# EAGLE design sensors (EAGLE 7.4.0)
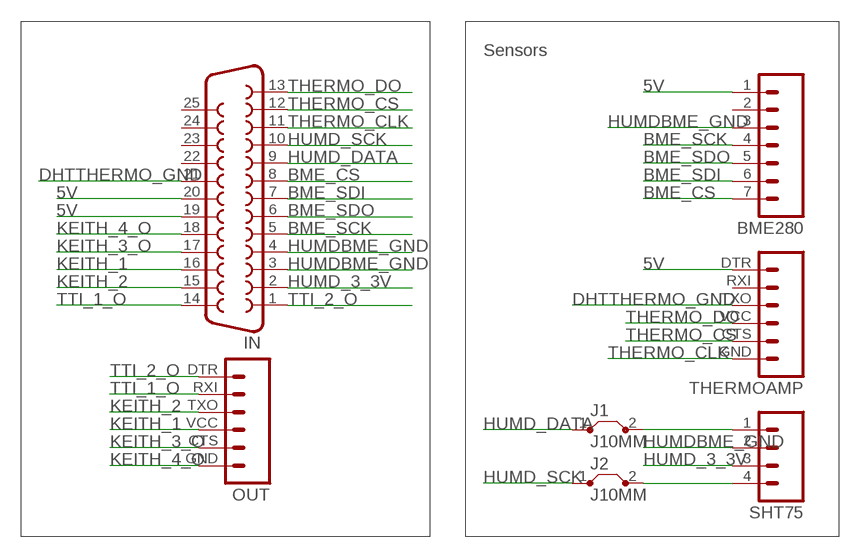
[diagram p0: schematic, sheet 1]

## Parts
BME280  M07  [1X07]
IN  F25HP  [F25HP]
J1  J10MM  [10]
J2  J10MM  [10]
OUT  M06SIP  [1X06]
SHT75  M04SMD_LONG  [1X04-SMD_LONG]
THERMOAMP  M06SIP  [1X06]

## Nets
5V: BME280.1 IN.19 IN.20 THERMOAMP.DTR
BME_CS: BME280.7 IN.8
BME_SCK: BME280.4 IN.5
BME_SDI: BME280.6 IN.7
BME_SDO: BME280.5 IN.6
DHTTHERMO_GND: IN.21 THERMOAMP.TXO
HUMD_3_3V: IN.2 SHT75.3
HUMD_DATA: IN.9 J1.1
HUMD_SCK: IN.10 J2.1
HUMDBME_GND: BME280.3 IN.3 IN.4 SHT75.2
KEITH_1: IN.16 OUT.VCC
KEITH_2: IN.15 OUT.TXO
KEITH_3_O: IN.17 OUT.CTS
KEITH_4_O: IN.18 OUT.GND
N$1: J1.2 SHT75.1
N$2: J2.2 SHT75.4
THERMO_CLK: IN.11 THERMOAMP.GND
THERMO_CS: IN.12 THERMOAMP.CTS
THERMO_DO: IN.13 THERMOAMP.VCC
TTI_1_O: IN.14 OUT.RXI
TTI_2_O: IN.1 OUT.DTR
Unconnected: BME280.2 IN.22 IN.23 IN.24 IN.25 THERMOAMP.RXI

## Notes on the sheet
- Sensors

## Library data of the parts
BME280 = SparkFun-Connectors:M07: Header 7 Standard 7-pin 0.1" header. Use with straight break away headers (SKU : PRT-00116), right angle break away headers (PRT-00553), swiss pins (PRT-00743), machine pins (PRT-00117), and female headers (PRT-00115). NOTES ON THE VARIANTS LOCK and LOCK_LONGPADS... This footprint was designed to help hold the alignment of a through-hole component (i.e. 7-pin header) while soldering it into place. You may notice that each hole has been shifted either up or down by 0.005 of an inch from it's more standard position (which is usually a perfectly straight line). This slight alteration caused the pins (the squares in the middle) to touch the edges of the holes. Because they are alternating, it causes a "brace" to hold the header in place. 0.005 has proven to be the perfect amount of "off-center" position when using our standard breakaway headers. Although looks a little odd when you look at the bare footprint, once you have a header in there, the alteration is very hard to notice. Also, if you push a header all the way into place, it is covered up entirely on the bottom side. This idea of altering the position of holes to aid alignment will be further integrated into the Sparkfun Library for other footprints. It can help hold any component with 3 or more connection pins.
IN = SparkFun-Connectors:F25: 25 Pin male connector. PCB edge mount for regular PCB thicknesses. This connector will connect directly to the back of a PC parallel port or through a normal DB25 extension cable (M/F). SKU: PRT-08287
J1 J2 = jumper:J: Bridge
OUT THERMOAMP = SparkFun-Connectors:M06: Header 6 Standard 6-pin 0.1" header. Use with straight break away headers (SKU : PRT-00116), right angle break away headers (PRT-00553), swiss pins (PRT-00743), machine pins (PRT-00117), and female headers (PRT-00115). Molex polarized connector foot print use with SKU : PRT-08094 with associated crimp pins and housings. NOTES ON THE VARIANTS LOCK and LOCK_LONGPADS... This footprint was designed to help hold the alignment of a through-hole component (i.e. 6-pin header) while soldering it into place. You may notice that each hole has been shifted either up or down by 0.005 of an inch from it's more standard position (which is a perfectly straight line). This slight alteration caused the pins (the squares in the middle) to touch the edges of the holes. Because they are alternating, it causes a "brace" to hold the component in place. 0.005 has proven to be the perfect amount of "off-center" position when using our standard breakaway headers. Although looks a little odd when you look at the bare footprint, once you have a header in there, the alteration is very hard to notice. Also,if you push a header all the way into place, it is covered up entirely on the bottom side. This idea of altering the position of holes to aid alignment will be further integrated into the Sparkfun Library for other footprints. It can help hold any component with 3 or more connection pins.
SHT75 = SparkFun-Connectors:M04: Header 4 Standard 4-pin 0.1" header. Use with straight break away headers (SKU : PRT-00116), right angle break away headers (PRT-00553), swiss pins (PRT-00743), machine pins (PRT-00117), and female headers (PRT-00115). Molex polarized connector foot print use with SKU : PRT-08231 with associated crimp pins and housings. 1MM SMD Version SKU: PRT-10208

## Net classes
0 default: width 0.254 mm, clearance 0.254 mm

## Board
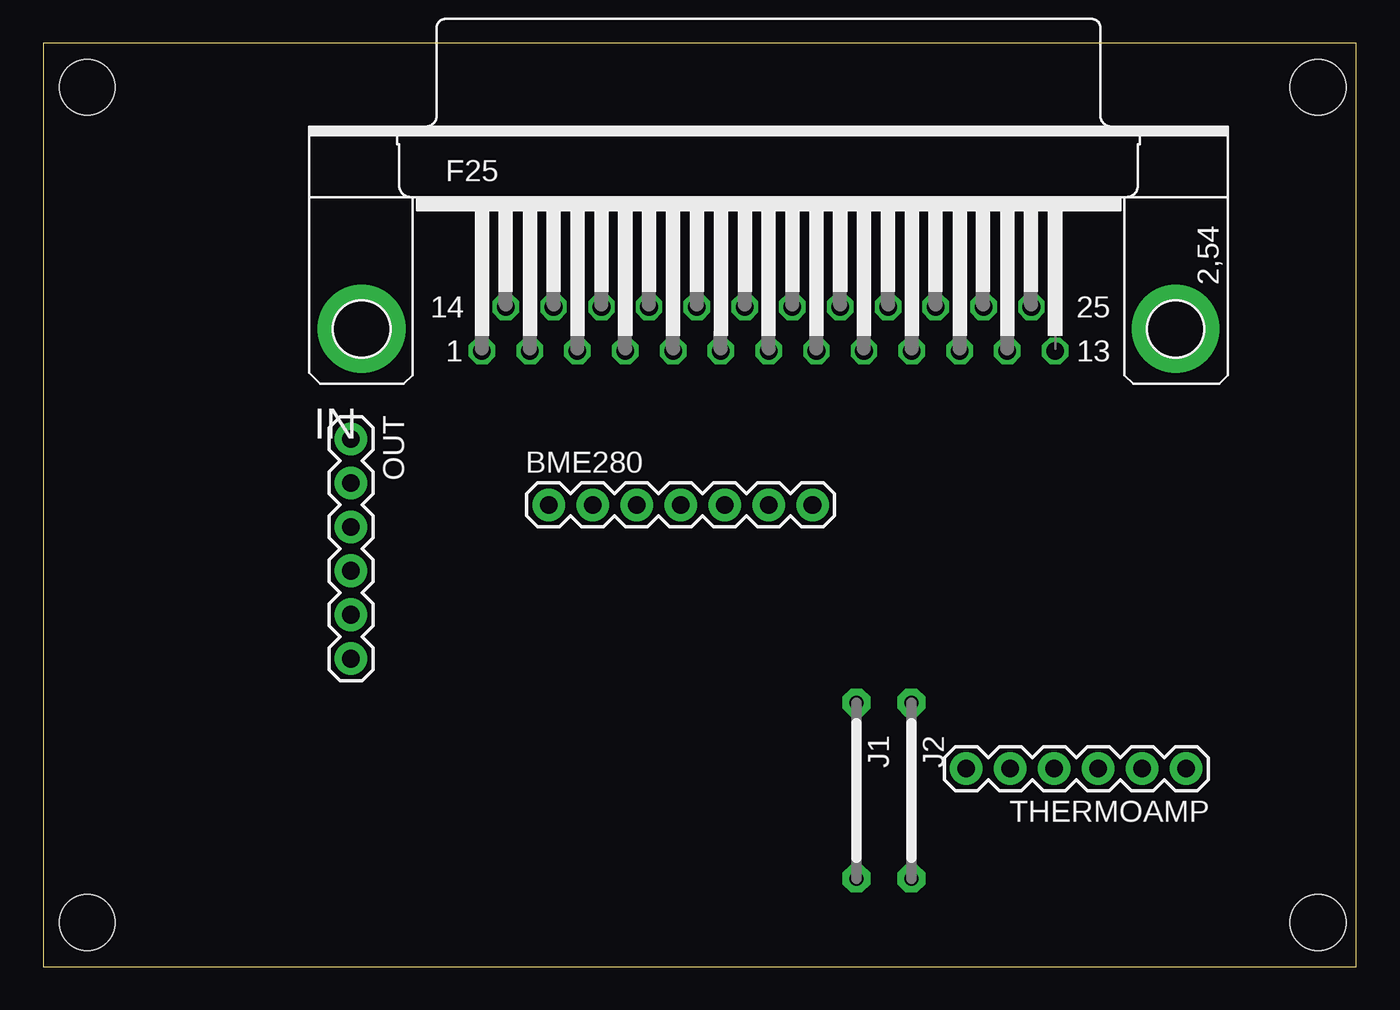
[diagram p1: board, top side]
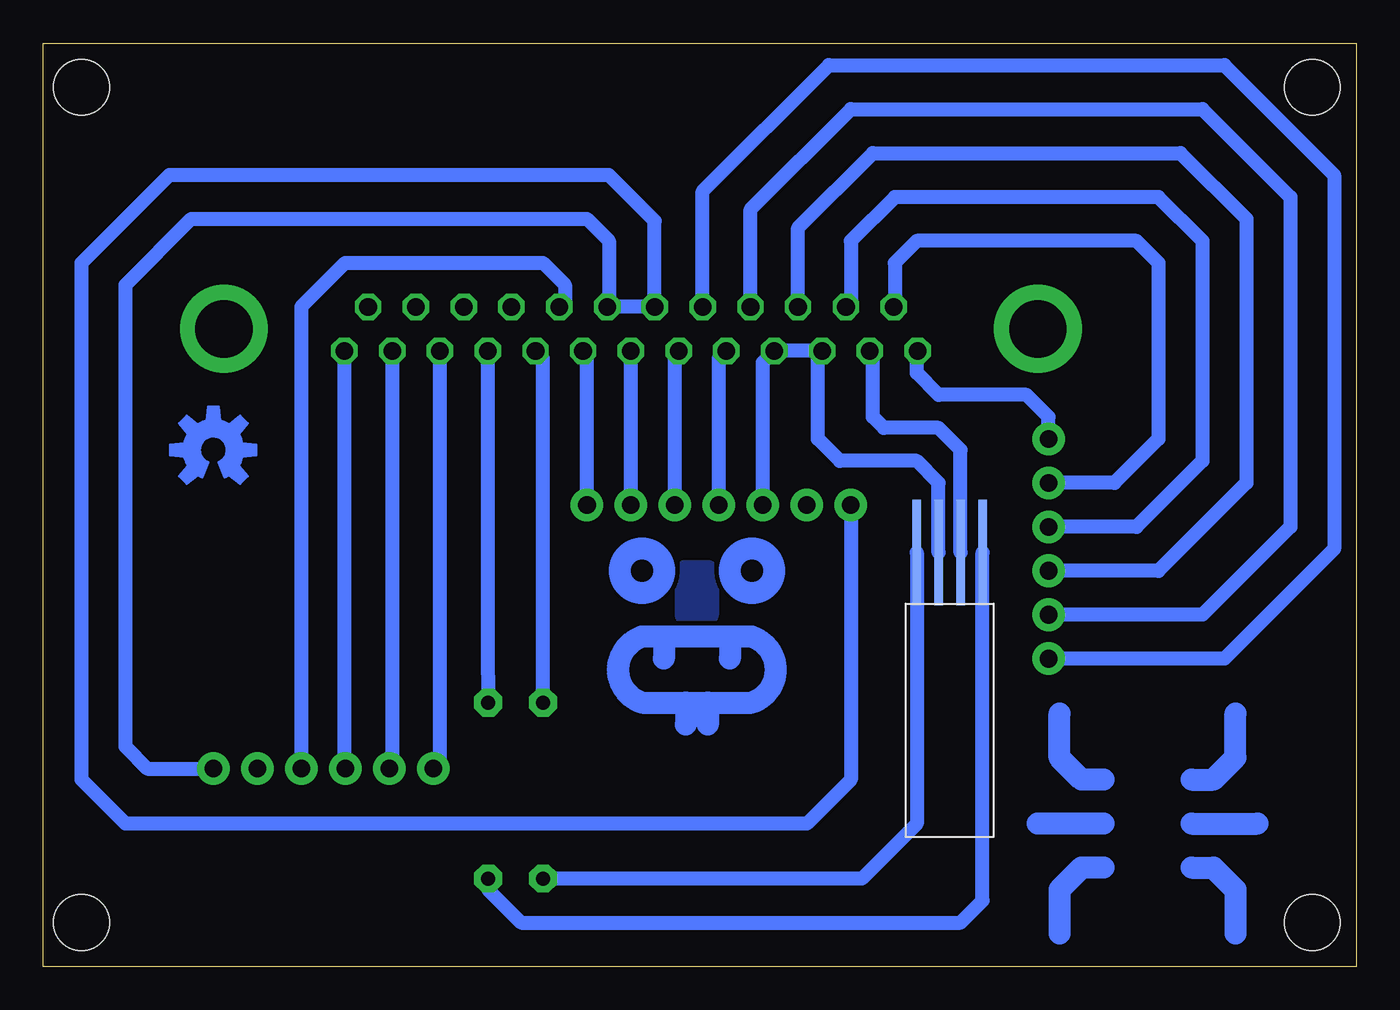
[diagram p2: board, bottom side, seen from below]

Size 75.87 x 53.33 mm. Coordinates in mm from the lower left corner, seen from the top.
Outline: 0,0 75.87,0 75.87,53.33 0,53.33 0,0
Copper layers (1*16): Top 0.035mm / dielectric 1.5mm / Bottom 0.035mm
Design rules "default": minimum track width 10mil, minimum drill 24mil, track to track 8mil, track to pad 8mil, pad to pad 8mil, via to via 8mil, smd to smd 8mil, copper to edge 40mil, drill to drill 8mil, minimum pad ring 10mil, minimum via ring 8mil, stop-mask expansion 4mil, vias tented up to drill 0mil, thermal gap 10mil
Holes 3.2 mm at 2.54,50.8 73.66,50.8 2.54,2.54 73.66,2.54

### Footprints (pad centres in the part's own frame; a part is rotated, then mirrored left to right if it is on the bottom)
1X07 = drill 1.016 pad 1.88: 1 0,0; 2 2.54,0; 3 5.08,0; 4 7.62,0; 5 10.16,0; 6 12.7,0; 7 15.24,0
F25HP = drill 1.016 octagon: 1 -16.561,-1.27; 2 -13.792,-1.27; 3 -11.049,-1.27; 4 -8.28,-1.27; 5 -5.512,-1.27; 6 -2.769,-1.27; 7 0,-1.27; 8 2.769,-1.27; 9 5.512,-1.27; 10 8.28,-1.27; 11 11.049,-1.27; 12 13.792,-1.27; 13 16.561,-1.27; 14 -15.189,1.27; 15 -12.421,1.27; 16 -9.652,1.27; 17 -6.909,1.27; 18 -4.14,1.27; 19 -1.372,1.27; 20 1.372,1.27; 21 4.14,1.27; 22 6.909,1.27; 23 9.652,1.27; 24 12.421,1.27; 25 15.189,1.27 | drill 3.302 pad 5.08: G1 -23.52,0; G2 23.52,0
10 = drill 0.813 pad 1.6 octagon: 1 -5.08,0; 2 5.08,0
1X06 = drill 1.016 pad 1.88: CTS 10.16,0; DTR 0,0; GND 12.7,0; RXI 2.54,0; TXO 5.08,0; VCC 7.62,0
1X04-SMD_LONG = smd 0.508 x 6.096: 1 -1.905,5.5; 2 -0.635,5.5; 3 0.635,5.5; 4 1.905,5.5

### Placement (x,y rotation side)
BME280  29.21,26.67 0 top
IN  41.91,36.83 0 top
J1  46.99,10.16 270 top
J2  50.16,10.16 270 top
OUT  17.78,30.48 270 top
SHT75  23.5,18.41 0 bottom
THERMOAMP  66.04,11.43 180 top
U$1  [OSHW-LOGO-M]  66.04,29.84 0 top

### Tracks (layer width: path | path; a pad name or v marks a point on that pad's centre or on a via)
5V
  Bottom 0.813: THERMOAMP.DTR 69.85,11.43 71.12,12.7 71.12,39.37 67.31,43.18 44.45,43.18 43.18,41.91 43.18,38.2 IN.20 IN.19 40.54,43.08 43.18,45.72 68.58,45.72 73.66,40.64 73.66,13.34 73.66,12.7 73.66,10.79 71.12,8.26 31.75,8.26 29.21,10.79 BME280.1
BME_CS
  Bottom 0.813: BME280.7 44.45,35.33 IN.8
BME_SCK
  Bottom 0.813: BME280.4 36.83,35.13 IN.5
BME_SDI
  Bottom 0.813: BME280.6 IN.7
BME_SDO
  Bottom 0.813: BME280.5 39.37,35.33 IN.6
DHTTHERMO_GND
  Bottom 0.813: IN.21 45.72,38.43 45.72,39.37 46.99,40.64 58.42,40.64 60.96,38.1 THERMOAMP.TXO
HUMD_3_3V
  Bottom 0.813: IN.2 27.94,35.38 27.94,31.75 27.3,31.11 24.13,31.11 22.86,29.84 SHT75.3
HUMD_DATA
  Bottom 0.813: J1.1 46.99,35.13 IN.9
HUMD_SCK
  Bottom 0.813: IN.10 50.19,18.44 J2.1
HUMDBME_GND
  Bottom 0.813: SHT75.2 24.13,27.94 25.4,29.21 29.84,29.21 31.11,30.48 31.11,35.31 IN.3 IN.4 34.29,34.9 BME280.3
KEITH_1
  Bottom 0.813: IN.16 32.26,42.67 27.94,46.99 10.16,46.99 6.35,43.18 6.35,27.94 11.43,22.86 OUT.VCC
KEITH_2
  Bottom 0.813: IN.15 29.21,38.38 29.21,41.91 26.67,44.45 11.43,44.45 8.89,41.91 8.89,29.21 12.7,25.4 OUT.TXO
KEITH_3_O
  Bottom 0.813: IN.17 35,43.74 29.21,49.53 8.89,49.53 3.81,44.45 3.81,25.4 8.89,20.32 OUT.CTS
KEITH_4_O
  Bottom 0.813: IN.18 37.77,44.78 30.48,52.07 7.62,52.07 1.27,45.72 1.27,24.13 7.62,17.78 OUT.GND
N$1
  Bottom 0.813: SHT75.1 25.4,8.26 28.57,5.08 J1.2
N$2
  Bottom 0.813: SHT75.4 21.59,3.81 22.86,2.54 48.26,2.54 50.16,4.45 J2.2
N$3
  Bottom 1.27: 41.27,15.24 arc143 41.27,19.05 34.92,19.05 arc143 34.92,15.24
N$4
  Bottom 1.27: 40.01,19.05 40.01,17.78
N$5
  Bottom 1.27: 41.27,15.24 38.73,15.24 | 38.73,15.24 38.73,13.97 | 37.47,15.24 37.47,13.97 | 37.47,15.24 34.92,15.24 | 38.73,15.24 37.47,15.24
N$6
  pour Bottom: 37.47,22.86 37.47,20.32 38.73,20.32 38.73,22.86
N$7
  Bottom 1.27: 36.2,19.05 36.2,17.78
N$8
  Bottom 1.27: 9.53,5.71 8.26,5.71 6.99,4.45 6.99,1.91
N$9
  Bottom 1.27: 6.99,14.61 6.99,12.06 8.26,10.79 9.53,10.79
N$10
  Bottom 1.27: 17.14,14.61 17.14,12.06 15.88,10.79 14.61,10.79
N$11
  Bottom 1.27: 14.61,8.26 18.41,8.26
N$12
  Bottom 1.27: 14.61,5.71 15.88,5.71 17.14,4.45 17.14,1.91
N$13
  Bottom 1.27: 9.53,8.26 5.71,8.26
THERMO_CLK
  Bottom 0.813: IN.11 52.96,11.81 THERMOAMP.GND
THERMO_CS
  Bottom 0.813: IN.12 55.7,11.61 THERMOAMP.CTS
THERMO_DO
  Bottom 0.813: IN.13 58.47,11.48 THERMOAMP.VCC
TTI_1_O
  Bottom 0.813: IN.14 26.67,38.15 26.67,40.64 25.4,41.91 12.7,41.91 11.43,40.64 11.43,30.48 13.97,27.94 OUT.RXI
TTI_2_O
  Bottom 0.813: OUT.DTR 17.78,31.75 19.05,33.02 24.13,33.02 25.4,34.29 25.4,35.51 IN.1
(copper drawn outside any net)
  shapes: Bottom circle x2